# Altium project AVR32DA48_DEV.PrjPcb
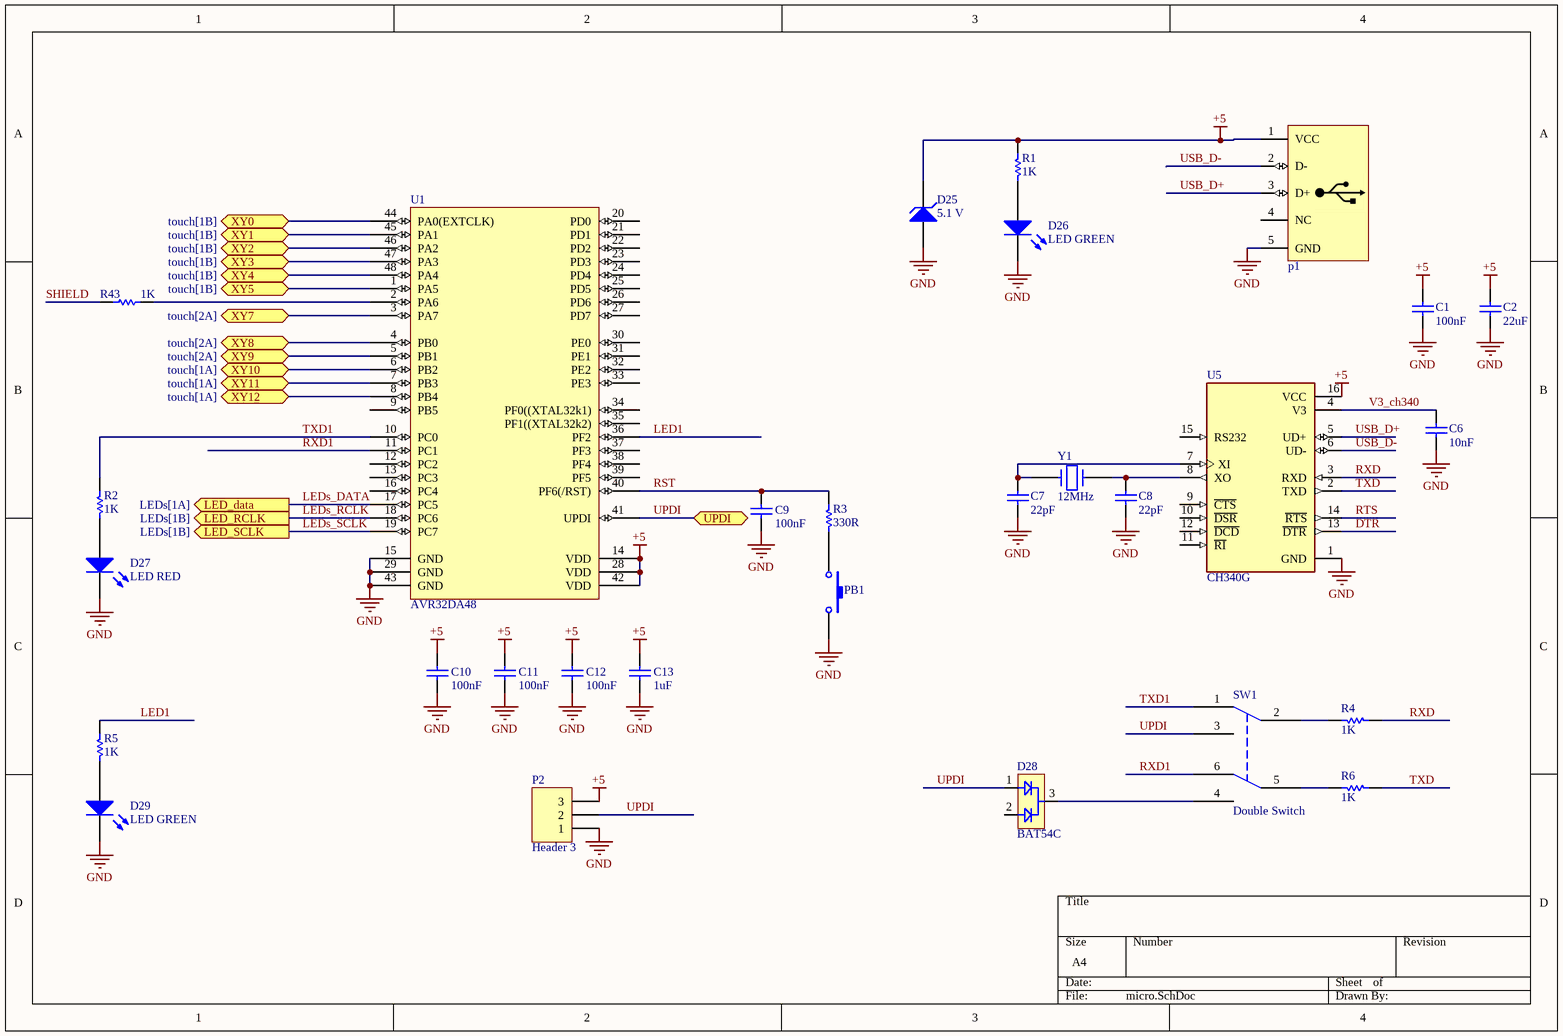
[diagram p0: micro.SchDoc]
3 sheets, 122 parts. Net scope: flat (ports and power ports of the same name join across sheets).
Board file: QTouch_test1.PcbDoc
Sheets:
  micro.SchDoc
  touch.SchDoc
  LEDs.SchDoc

## Sheet micro.SchDoc
size A4; SheetNumber: 1; SheetTotal: 3

### Parts
C1  100nF  [SMD_CAP_0805]
C2  22uF  [SMD_CAP_0805]
C6  10nF  [SMD_CAP_0805]
C7  22pF  [SMD_CAP_0805]
C8  22pF  [SMD_CAP_0805]
C9  value 100nF  [CAP0805]  (hidden comment: cap 100nF)
C10  value 100nF  [CAP0805]  (hidden comment: cap 100nF)
C11  value 100nF  [CAP0805]  (hidden comment: cap 100nF)
C12  value 100nF  [CAP0805]  (hidden comment: cap 100nF)
C13  value 1uF  [CAP0805]  (hidden comment: cap 1uF)
D25  Voltage: 5.1 V  [Diode 1n4148 SMD]  (hidden comment: Diode Zener)
D26  LED GREEN  [LED_0805 G]
D27  LED RED  [LED_0805 G]
D28  BAT54C  [SOT-23]
D29  LED GREEN  [LED_0805 G]
p1  USB Connector  [USB_AB_BM_SHS]  (value not drawn)
P2  Header 3  [HDR1X3]
PB1  Push-Button-tall  [tack-sw-3x5x6]  (value not drawn)
R1  value 1K  [RES0805]  (hidden comment: Res 1K)
R2  value 1K  [RES0805]  (hidden comment: Res 1K)
R3  value 330R  [RES0805]  (hidden comment: Res 330R)
R4  value 1K  [RES0805]  (hidden comment: Res 1K)
R5  value 1K  [RES0805]  (hidden comment: Res 1K)
R6  value 1K  [RES0805]  (hidden comment: Res 1K)
R43  1K  [RES 0805 (2012X06L)]
SW1  Double Switch  [switch_2way_DPDT_right]
U1  AVR32DA48  [TQPF48]
U5  CH340G  [SOIC16_N]
Y1  12MHz  [XTAL_SMD]

### Ports
LED_data (out, see LEDs[1A]), LED_RCLK (out, see LEDs[1B]), LED_SCLK (out, see LEDs[1B]), UPDI (bidir), XY0 (bidir, see touch[1B]), XY1 (bidir, see touch[1B]), XY2 (bidir, see touch[1B]), XY3 (bidir, see touch[1B]), XY4 (bidir, see touch[1B]), XY5 (bidir, see touch[1B]), XY7 (bidir, see touch[2A]), XY8 (bidir, see touch[2A]), XY9 (bidir, see touch[2A]), XY10 (bidir, see touch[1A]), XY11 (bidir, see touch[1A]), XY12 (bidir, see touch[1A])

### Nets
+5: C1.2 C2.2 C10.2 C11.2 C12.2 C13.2 D25.2(K) p1.1(VCC) P2.3 R1.1 U1.14(VDD) U1.28(VDD) U1.42(VDD) U5.16(VCC)
GND: C1.1 C2.1 C6.1 C7.1 C8.1 C9.1 C10.1 C11.1 C12.1 C13.1 D25.1(A) D26.2(K) D27.2(K) D29.2(K) p1.5(GND) P2.1 PB1.1 U1.15(GND) U1.29(GND) U1.43(GND) U5.1(GND)
DTR: U5.13(~{DTR})
LED1: R5.1 U1.36(PF2)
LEDs_DATA: U1.17(PC5) ; port LED_data
LEDs_RCLK: U1.18(PC6) ; port LED_RCLK
LEDs_SCLK: U1.19(PC7) ; port LED_SCLK
RST: C9.2 R3.1 U1.40(PF6(/RST))
RTS: U5.14(~{RTS})
RXD: R4.2 U5.3(RXD)
RXD1: SW1.6 U1.11(PC1)
SHIELD: R43.2
TXD: R6.2 U5.2(TXD)
TXD1: R2.1 SW1.1 U1.10(PC0)
UPDI: D28.1 P2.2 SW1.3 U1.41(UPDI) ; port UPDI
USB_D+: p1.3(D+) U5.5(UD+)
USB_D-: p1.2(D-) U5.6(UD-)
V3_ch340: C6.2 U5.4(V3)
NetC7_2: C7.2 U5.7(XI) Y1.1
NetC8_2: C8.2 U5.8(XO) Y1.2
NetD26_1: D26.1(A) R1.2
NetD27_1: D27.1(A) R2.2
NetD28_3: D28.3 SW1.4
NetD29_1: D29.1(A) R5.2
NetPB1_2: PB1.2 R3.2
NetR4_1: R4.1 SW1.2
NetR6_1: R6.1 SW1.5
NetR7_2: U1.7(PB3) ; port XY11
NetR8_2: U1.5(PB1) ; port XY9
NetR9_2: U1.6(PB2) ; port XY10
NetR10_2: U1.3(PA7) ; port XY7
NetR11_2: U1.8(PB4) ; port XY12
NetR12_2: U1.4(PB0) ; port XY8
NetR13_2: U1.46(PA2) ; port XY2
NetR14_2: U1.45(PA1) ; port XY1
NetR15_2: U1.44(PA0(EXTCLK)) ; port XY0
NetR16_2: U1.1(PA5) ; port XY5
NetR41_2: U1.48(PA4) ; port XY4
NetR42_2: U1.47(PA3) ; port XY3
NetR43_1: R43.1 U1.2(PA6)

Not connected (* = marked no-connect by the designer): D28 2; p1 4(NC); U1 9(PB5) 12(PC2) 13(PC3) 16(PC4) 20(PD0) 21(PD1) 22(PD2) 23(PD3) 24(PD4) 25(PD5) 26(PD6) 27(PD7) 30(PE0) 31(PE1) 32(PE2) 33(PE3) 34(PF0((XTAL32k1)) 35(PF1((XTAL32k2)) 37(PF3) 38(PF4) 39(PF5); U5 9(~{CTS}) 10(~{DSR}) 11(~{RI}) 12(~{DCD}) 15(RS232)

### Library data of the parts
C1 C2 C6-C8 = Cap: CAP SMD 0805; Published: 8-Jun-2000; LatestRevisionDate: 17-Jul-2002; LatestRevisionNote: Re-released for DXP Platform.; PackageReference: RAD-0.3; Publisher: Altium Limited; PackageDescription: Radial Cap, Thru-Hole; 2 Leads; 0.3 in Pin Spacing
  C1: Value: 100nF
  C2: Value: 22uF
  C6: Value: 10nF
  C7 C8: Value: 22pF
C9-C13 = Cap ceramic: CAP seramic
D25 = Diode Zener: Zener Diode; Designer: Saeid Jorablo; Company: E.P.I.L; Design Date: 2011/11/02
D26 D29 = LED0: LED SMD 0805 GREEN; Published: 8-Jun-2000; LatestRevisionDate: 08-Jul-2005; LatestRevisionNote: Mech Layer 1 removed.; PackageReference: LED-0; Publisher: Altium Limited; PackageDescription: LED; 2 Leads
D27 = LED0: LED SMD 0805 RED; Published: 8-Jun-2000; LatestRevisionDate: 08-Jul-2005; LatestRevisionNote: Mech Layer 1 removed.; PackageReference: LED-0; Publisher: Altium Limited; PackageDescription: LED; 2 Leads
p1 = USB MICRO: USB Connector MICRO-B Type; Designer: ABBAS BASEREH; Max Current: 1600mA; Mounting Technology: Surface Mount\Through-Hole; Category: Connector; Pin Count: 5-7; Publisher: ABBAS BASEREH; Status: Unreleased; ComponentLink1Description: Datasheet; ComponentLink2Description: Reference; Update: 1395-11-17
P2 = Header 3: Header, 3-Pin; LatestRevisionDate: 17-Jul-2002; LatestRevisionNote: Re-released for DXP Platform.; Publisher: Altium Limited
R1-R6 R43 = Res1: Resistor; Published: 8-Jun-2000; LatestRevisionDate: 17-Jul-2002; LatestRevisionNote: Re-released for DXP Platform.; PackageReference: AXIAL-0.3; Publisher: Altium Limited; PackageDescription: Axial Device, Thru-Hole; 2 Leads; 0.3 in Pin Spacing
  R43: Value: 1K
SW1 = Switch - DPDT: DPDT Switch
U5 = CH340G: USB Interface Integrated Circuit; MF: WCH; Price: None; SnapEDA_Link: https://www.snapeda.com/parts/Ch340G/WCH/view-part/?ref=snap; MP: Ch340G; Value: *; Availability: Not in stock; Package: None; Check_prices: https://www.snapeda.com/parts/Ch340G/WCH/view-part/?ref=eda
Y1 = CRYSTAL

## Sheet touch.SchDoc
size A4; SheetNumber: 2; SheetTotal: 3
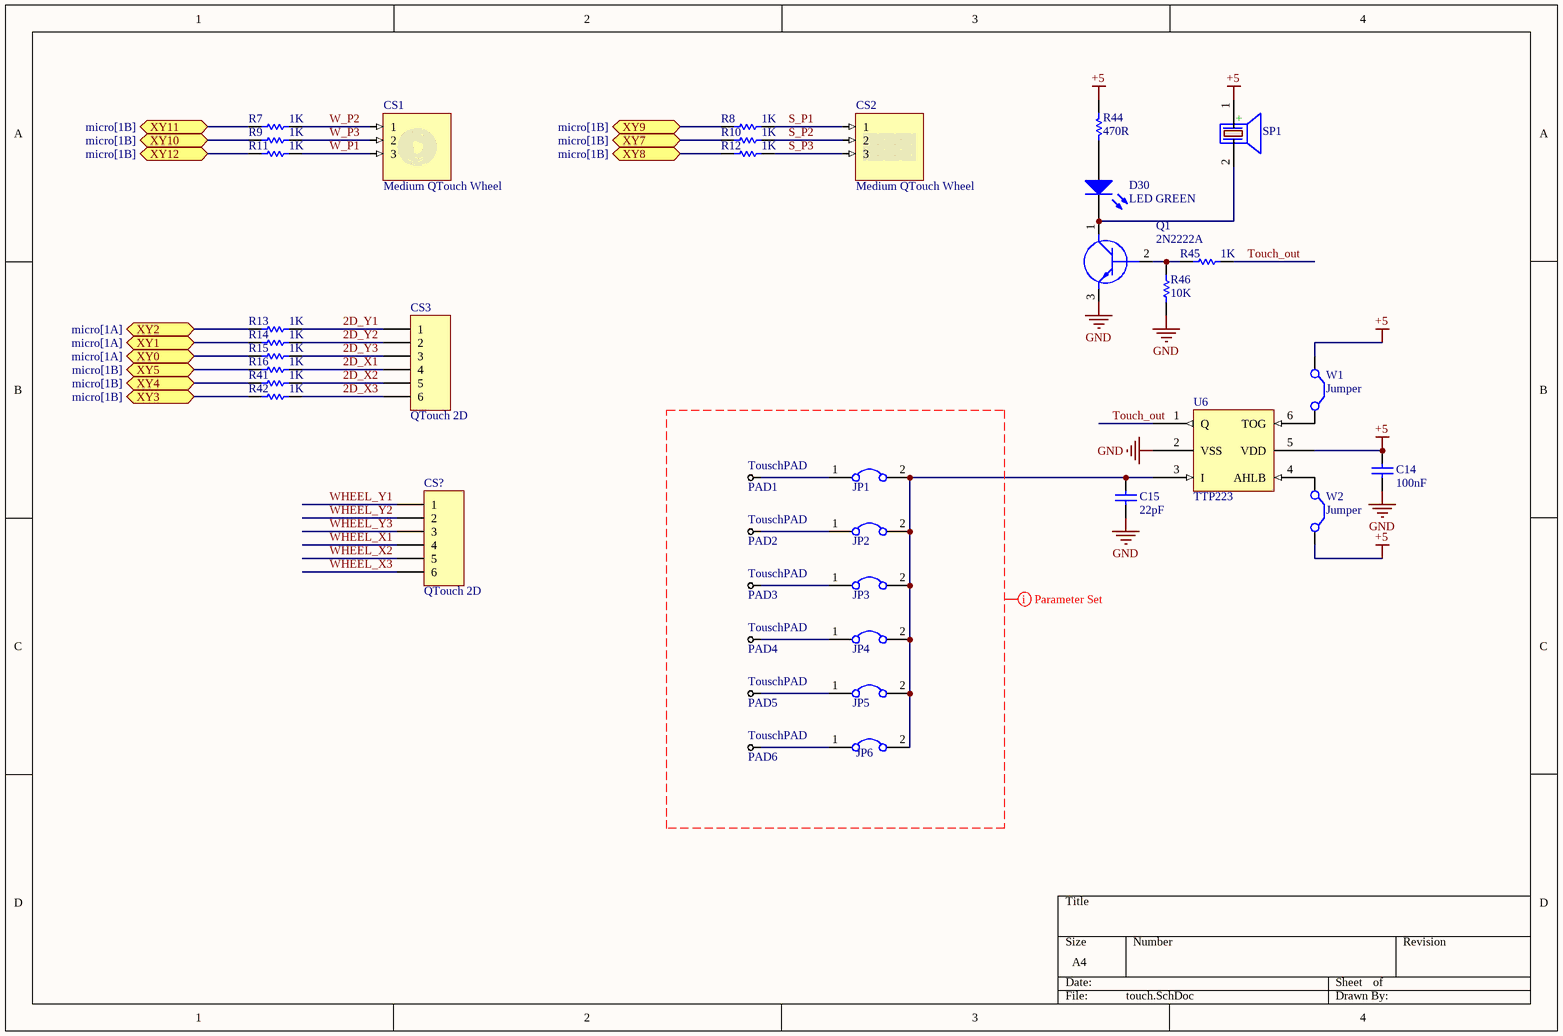
[diagram p1: touch.SchDoc]

### Parts
C14  value 100nF  [CAP0805]  (hidden comment: cap 100nF)
C15  value 22pF  [CAP0805]  (hidden comment: cap 22pF)
CS1  Medium QTouch Wheel  (no BOM)
CS2  Medium QTouch Wheel  (no BOM)
CS3  QTouch 2D  [2D_touch surface]
CS?  QTouch 2D  [wheel]
D30  LED GREEN  [LED_0805 G]
JP1  Jumper  [Jumper Small - 2.54 - GRAY]  (value not drawn)
JP2  Jumper  [Jumper Small - 2.54 - GRAY]  (value not drawn)
JP3  Jumper  [Jumper Small - 2.54 - GRAY]  (value not drawn)
JP4  Jumper  [Jumper Small - 2.54 - GRAY]  (value not drawn)
JP5  Jumper  [Jumper Small - 2.54 - GRAY]  (value not drawn)
JP6  Jumper  [Jumper Small - 2.54 - GRAY]  (value not drawn)
PAD1  TouschPAD  [touchpad1]  (no BOM)
PAD2  TouschPAD  [touchpad2]  (no BOM)
PAD3  TouschPAD  [touchpad3]  (no BOM)
PAD4  TouschPAD  [touchpad4]  (no BOM)
PAD5  TouschPAD  [touchpad5]  (no BOM)
PAD6  TouschPAD  [touchpad6]  (no BOM)
Q1  2N2222A  [SOT23_M]
R7  1K  [RES 0805 (2012X06L)]
R8  1K  [RES 0805 (2012X06L)]
R9  1K  [RES 0805 (2012X06L)]
R10  1K  [RES 0805 (2012X06L)]
R11  1K  [RES 0805 (2012X06L)]
R12  1K  [RES 0805 (2012X06L)]
R13  1K  [RES 0805 (2012X06L)]
R14  1K  [RES 0805 (2012X06L)]
R15  1K  [RES 0805 (2012X06L)]
R16  1K  [RES 0805 (2012X06L)]
R41  1K  [RES 0805 (2012X06L)]
R42  1K  [RES 0805 (2012X06L)]
R44  value 470R  [RES0805]  (hidden comment: Res 470R)
R45  1K  [RES 0805 (2012X06L)]
R46  10K  [RES 0805 (2012X06L)]
SP1  BUZZER  [BUZZER 7.62mm DC]  (value not drawn)
U6  TTP223  [SOT23-6_L]
W1  Jumper  [JUMPER]  (no BOM)
W2  Jumper  [JUMPER]  (no BOM)

### Ports
XY0 (bidir, see micro[1A]), XY1 (bidir, see micro[1A]), XY2 (bidir, see micro[1A]), XY3 (bidir, see micro[1B]), XY4 (bidir, see micro[1B]), XY5 (bidir, see micro[1B]), XY7 (bidir, see micro[1B]), XY8 (bidir, see micro[1B]), XY9 (bidir, see micro[1B]), XY10 (bidir, see micro[1B]), XY11 (bidir, see micro[1B]), XY12 (bidir, see micro[1B])

### Nets
+5: C14.2 R44.1 SP1.1(+) U6.5(VDD) W1.1(C1) W2.2(C2)
GND: C14.1 C15.1 Q1.3(E) R46.2 U6.2(VSS)
2D_X1: CS3.4 R16.1
2D_X2: CS3.5 R41.1
2D_X3: CS3.6 R42.1
2D_Y1: CS3.1 R13.1
2D_Y2: CS3.2 R14.1
2D_Y3: CS3.3 R15.1
S_P1: CS2.1 R8.1
S_P2: CS2.2 R10.1
S_P3: CS2.3 R12.1
Touch_out: R45.1 U6.1(Q)
W_P1: CS1.3 R11.1
W_P2: CS1.1 R7.1
W_P3: CS1.2 R9.1
WHEEL_X1: CS?.4
WHEEL_X2: CS?.5
WHEEL_X3: CS?.6
WHEEL_Y1: CS?.1
WHEEL_Y2: CS?.2
WHEEL_Y3: CS?.3
NetC15_2: C15.2 JP1.2 JP2.2 JP3.2 JP4.2 JP5.2 JP6.2 U6.3(I)
NetD30_1: D30.1(A) R44.2
NetD30_2: D30.2(K) Q1.1(C) SP1.2(-)
NetJP1_1: JP1.1 PAD1.1(T)
NetJP2_1: JP2.1 PAD2.1(T)
NetJP3_1: JP3.1 PAD3.1(T)
NetJP4_1: JP4.1 PAD4.1(T)
NetJP5_1: JP5.1 PAD5.1(T)
NetJP6_1: JP6.1 PAD6.1(T)
NetQ1_2: Q1.2(B) R45.2 R46.1
NetR7_2: R7.2 ; port XY11
NetR8_2: R8.2 ; port XY9
NetR9_2: R9.2 ; port XY10
NetR10_2: R10.2 ; port XY7
NetR11_2: R11.2 ; port XY12
NetR12_2: R12.2 ; port XY8
NetR13_2: R13.2 ; port XY2
NetR14_2: R14.2 ; port XY1
NetR15_2: R15.2 ; port XY0
NetR16_2: R16.2 ; port XY5
NetR41_2: R41.2 ; port XY4
NetR42_2: R42.2 ; port XY3
NetU6_4: U6.4(AHLB) W2.1(C1)
NetU6_6: U6.6(TOG) W1.2(C2)

### Layout directives
net class touch_pads: (no net found under the mark)

### Library data of the parts
C14 C15 = Cap ceramic: CAP seramic
CS1 = MediumQTouchWheel: ConfiguratorName: ATMEL_TOUCH; ConfigurationParameters: {}__sensorid[8]{}odiameter[60]{}idiameter[30]{}gapthickness[0.3]{}
CS2 = MediumQTouchWheel: ConfiguratorName: ATMEL_TOUCH; ConfigurationParameters: {}__sensorid[4]{}width[50]{}height[12]{}gapthickness[0.3]{}
CS3 CS? = Header 6: 3 by 3 2D touch surface; LatestRevisionDate: 17-Jul-2002; LatestRevisionNote: Re-released for DXP Platform.; Publisher: Altium Limited
D30 = LED0: LED SMD 0805 GREEN; Published: 8-Jun-2000; LatestRevisionDate: 08-Jul-2005; LatestRevisionNote: Mech Layer 1 removed.; PackageReference: LED-0; Publisher: Altium Limited; PackageDescription: LED; 2 Leads
JP1-JP6 = Jumper: Company: E.P.I.L; Defualt State: Close; Design Date: 2011/11/02
PAD1-PAD6 = Test Point
Q1 = 2N2222A: Transistor BJT NPN SMD; Manufacturer_Name: Foshan Blue Rocket Elec; Datasheet Link: https://datasheet.lcsc.com/szlcsc/1901291437_Foshan-Blue-Rocket-Elec-2N2222A_C358533.pdf; Height: 4.7mm; Manufacturer_Part_Number: 2N2222A
R7-R16 R41 R42 R44-R46 = Res1: Resistor; Published: 8-Jun-2000; LatestRevisionDate: 17-Jul-2002; LatestRevisionNote: Re-released for DXP Platform.; PackageReference: AXIAL-0.3; Publisher: Altium Limited; PackageDescription: Axial Device, Thru-Hole; 2 Leads; 0.3 in Pin Spacing
  R7-R16 R41 R42 R45: Value: 1K
  R46: Value: 10K
SP1 = PIEZO BUZZER: PIEZO BUZZER 5VOLTS; Designer: Abbas Basereh; Comment_1: SPEAKER AND BEEP; Design Date: 1395/11/14; ComponentLink2Description: Reference; PackageDescription: THD; Publisher: Abbas Basereh; Mounting Technology: THD; Pin Count: 2; Status: Unreleased
U6 = ttp223b: capacitive touch IC
W1 W2 = Jumper: Jumper Wire; Published: 24-Mar-1999; LatestRevisionDate: 17-Jul-2002; LatestRevisionNote: Re-released for DXP Platform.; PackageReference: RAD-0.2; Publisher: Altium Limited; PackageDescription: Radial Cap, Thru-Hole; 2 Leads; 0.2 in Pin Spacing

## Sheet LEDs.SchDoc
size A4; SheetNumber: 3; SheetTotal: 3
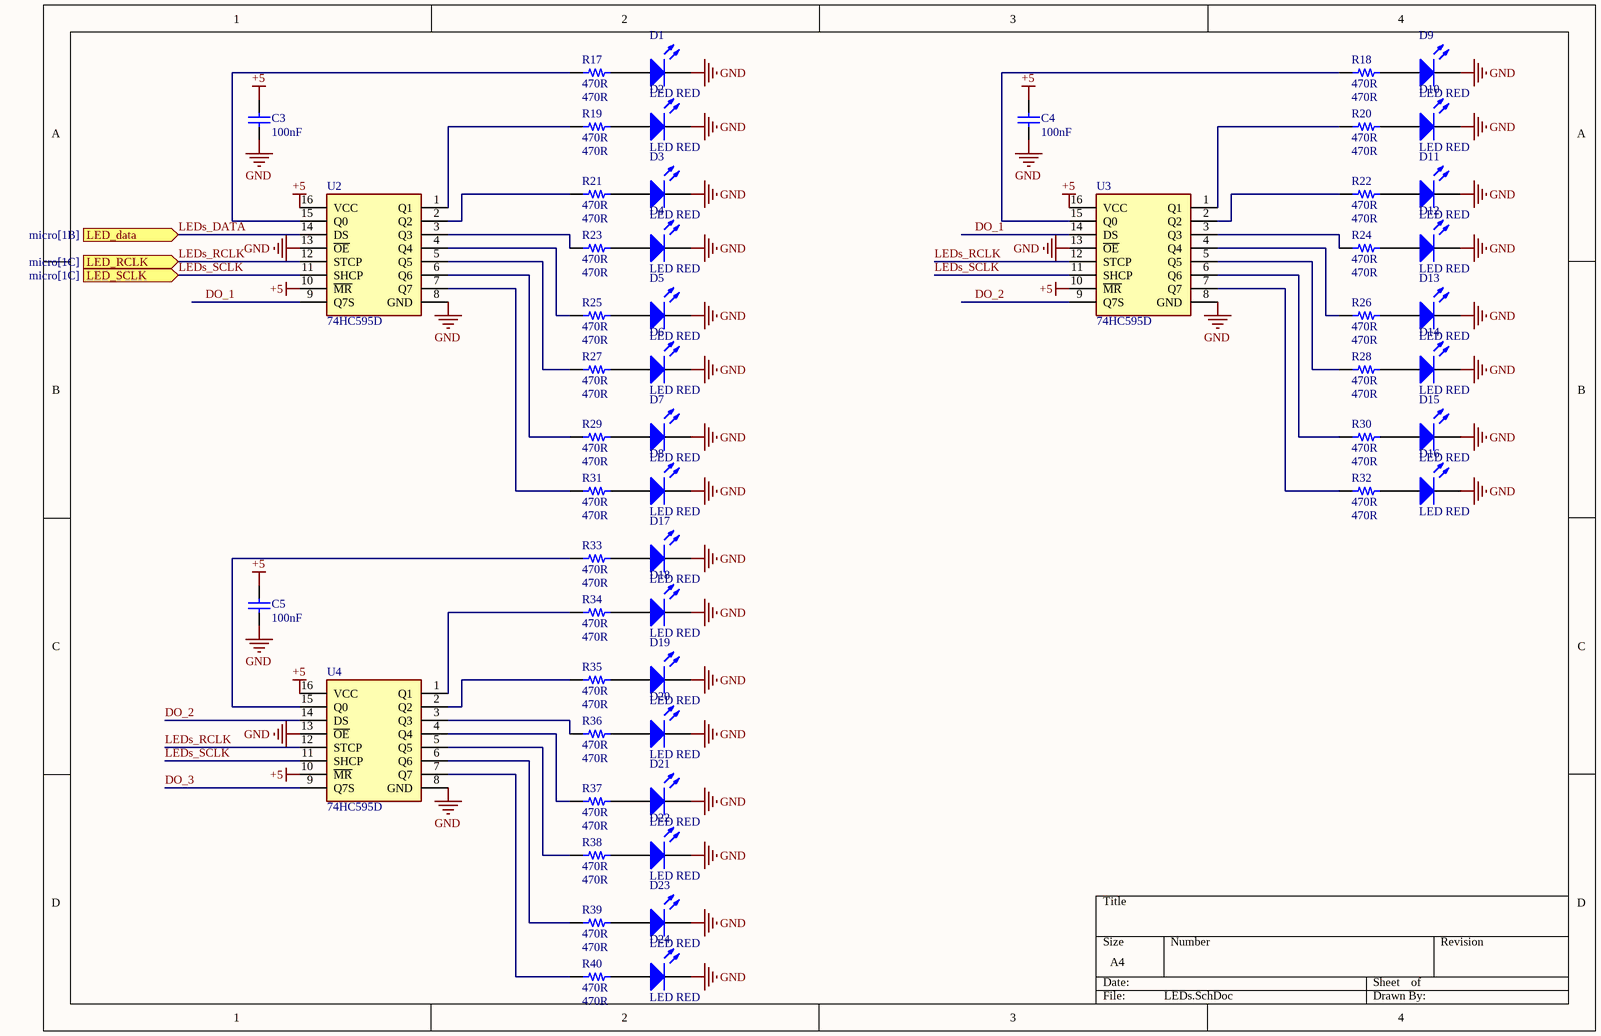
[diagram p2: LEDs.SchDoc]

### Parts
C3  100nF  [SMD_CAP_0805]
C4  100nF  [SMD_CAP_0805]
C5  100nF  [SMD_CAP_0805]
D1  LED RED  [LED_0805 G]
D2  LED RED  [LED_0805 G]
D3  LED RED  [LED_0805 G]
D4  LED RED  [LED_0805 G]
D5  LED RED  [LED_0805 G]
D6  LED RED  [LED_0805 G]
D7  LED RED  [LED_0805 G]
D8  LED RED  [LED_0805 G]
D9  LED RED  [LED_0805 G]
D10  LED RED  [LED_0805 G]
D11  LED RED  [LED_0805 G]
D12  LED RED  [LED_0805 G]
D13  LED RED  [LED_0805 G]
D14  LED RED  [LED_0805 G]
D15  LED RED  [LED_0805 G]
D16  LED RED  [LED_0805 G]
D17  LED RED  [LED_0805 G]
D18  LED RED  [LED_0805 G]
D19  LED RED  [LED_0805 G]
D20  LED RED  [LED_0805 G]
D21  LED RED  [LED_0805 G]
D22  LED RED  [LED_0805 G]
D23  LED RED  [LED_0805 G]
D24  LED RED  [LED_0805 G]
R17  470R  [RES0805]
R18  470R  [RES0805]
R19  470R  [RES0805]
R20  470R  [RES0805]
R21  470R  [RES0805]
R22  470R  [RES0805]
R23  470R  [RES0805]
R24  470R  [RES0805]
R25  470R  [RES0805]
R26  470R  [RES0805]
R27  470R  [RES0805]
R28  470R  [RES0805]
R29  470R  [RES0805]
R30  470R  [RES0805]
R31  470R  [RES0805]
R32  470R  [RES0805]
R33  470R  [RES0805]
R34  470R  [RES0805]
R35  470R  [RES0805]
R36  470R  [RES0805]
R37  470R  [RES0805]
R38  470R  [RES0805]
R39  470R  [RES0805]
R40  470R  [RES0805]
U2  74HC595D  [SOIC127P600X175-16N]
U3  74HC595D  [SOIC127P600X175-16N]
U4  74HC595D  [SOIC127P600X175-16N]

### Ports
LED_data (in, see micro[1B]), LED_RCLK (in, see micro[1C]), LED_SCLK (in, see micro[1C])

### Nets
+5: C3.2 C4.2 C5.2 U2.10(~{MR}) U2.16(VCC) U3.10(~{MR}) U3.16(VCC) U4.10(~{MR}) U4.16(VCC)
GND: C3.1 C4.1 C5.1 D1.2(K) D2.2(K) D3.2(K) D4.2(K) D5.2(K) D6.2(K) D7.2(K) D8.2(K) D9.2(K) D10.2(K) D11.2(K) D12.2(K) D13.2(K) D14.2(K) D15.2(K) D16.2(K) D17.2(K) D18.2(K) D19.2(K) D20.2(K) D21.2(K) D22.2(K) D23.2(K) D24.2(K) U2.8(GND) U2.13(~{OE}) U3.8(GND) U3.13(~{OE}) U4.8(GND) U4.13(~{OE})
DO_1: U2.9(Q7S) U3.14(DS)
DO_2: U3.9(Q7S) U4.14(DS)
DO_3: U4.9(Q7S)
LEDs_DATA: U2.14(DS) ; port LED_data
LEDs_RCLK: U2.12(STCP) U3.12(STCP) U4.12(STCP) ; port LED_RCLK
LEDs_SCLK: U2.11(SHCP) U3.11(SHCP) U4.11(SHCP) ; port LED_SCLK
NetD1_1: D1.1(A) R17.1
NetD2_1: D2.1(A) R19.1
NetD3_1: D3.1(A) R21.1
NetD4_1: D4.1(A) R23.1
NetD5_1: D5.1(A) R25.1
NetD6_1: D6.1(A) R27.1
NetD7_1: D7.1(A) R29.1
NetD8_1: D8.1(A) R31.1
NetD9_1: D9.1(A) R18.1
NetD10_1: D10.1(A) R20.1
NetD11_1: D11.1(A) R22.1
NetD12_1: D12.1(A) R24.1
NetD13_1: D13.1(A) R26.1
NetD14_1: D14.1(A) R28.1
NetD15_1: D15.1(A) R30.1
NetD16_1: D16.1(A) R32.1
NetD17_1: D17.1(A) R33.1
NetD18_1: D18.1(A) R34.1
NetD19_1: D19.1(A) R35.1
NetD20_1: D20.1(A) R36.1
NetD21_1: D21.1(A) R37.1
NetD22_1: D22.1(A) R38.1
NetD23_1: D23.1(A) R39.1
NetD24_1: D24.1(A) R40.1
NetR17_2: R17.2 U2.15(Q0)
NetR18_2: R18.2 U3.15(Q0)
NetR19_2: R19.2 U2.1(Q1)
NetR20_2: R20.2 U3.1(Q1)
NetR21_2: R21.2 U2.2(Q2)
NetR22_2: R22.2 U3.2(Q2)
NetR23_2: R23.2 U2.3(Q3)
NetR24_2: R24.2 U3.3(Q3)
NetR25_2: R25.2 U2.4(Q4)
NetR26_2: R26.2 U3.4(Q4)
NetR27_2: R27.2 U2.5(Q5)
NetR28_2: R28.2 U3.5(Q5)
NetR29_2: R29.2 U2.6(Q6)
NetR30_2: R30.2 U3.6(Q6)
NetR31_2: R31.2 U2.7(Q7)
NetR32_2: R32.2 U3.7(Q7)
NetR33_2: R33.2 U4.15(Q0)
NetR34_2: R34.2 U4.1(Q1)
NetR35_2: R35.2 U4.2(Q2)
NetR36_2: R36.2 U4.3(Q3)
NetR37_2: R37.2 U4.4(Q4)
NetR38_2: R38.2 U4.5(Q5)
NetR39_2: R39.2 U4.6(Q6)
NetR40_2: R40.2 U4.7(Q7)

### Library data of the parts
C3-C5 = Cap: CAP SMD 0805; Published: 8-Jun-2000; LatestRevisionDate: 17-Jul-2002; LatestRevisionNote: Re-released for DXP Platform.; PackageReference: RAD-0.3; Publisher: Altium Limited; PackageDescription: Radial Cap, Thru-Hole; 2 Leads; 0.3 in Pin Spacing; Value: 100nF
D1-D24 = LED0: LED SMD 0805 RED; Published: 8-Jun-2000; LatestRevisionDate: 08-Jul-2005; LatestRevisionNote: Mech Layer 1 removed.; PackageReference: LED-0; Publisher: Altium Limited; PackageDescription: LED; 2 Leads
R17-R40 = Resistor: RES SMD 0603; Part Number: RCS0805100KFKEA; Value: 470R
U2-U4 = 74HC595D: 74HC595 SMD; Manufacturer_Name: Nexperia; Datasheet Link: https://componentsearchengine.com/Datasheets/2/74HC595D.pdf; Height: 1.75mm; Manufacturer_Part_Number: 74HC595D; Mouser Part Number: N/A; Mouser Price/Stock: https://www.mouser.com/Search/Refine.aspx?Keyword=N%2FA

## Nets that join several sheets
+5: micro (14 pins), touch (6 pins), LEDs (9 pins)
GND: micro (21 pins), touch (5 pins), LEDs (33 pins)
LEDs_DATA: micro (U1.17), LEDs (U2.14)
LEDs_RCLK: micro (U1.18), LEDs (U2.12 U3.12 U4.12)
LEDs_SCLK: micro (U1.19), LEDs (U2.11 U3.11 U4.11)
NetR7_2: micro (U1.7), touch (R7.2)
NetR8_2: micro (U1.5), touch (R8.2)
NetR9_2: micro (U1.6), touch (R9.2)
NetR10_2: micro (U1.3), touch (R10.2)
NetR11_2: micro (U1.8), touch (R11.2)
NetR12_2: micro (U1.4), touch (R12.2)
NetR13_2: micro (U1.46), touch (R13.2)
NetR14_2: micro (U1.45), touch (R14.2)
NetR15_2: micro (U1.44), touch (R15.2)
NetR16_2: micro (U1.1), touch (R16.2)
NetR41_2: micro (U1.48), touch (R41.2)
NetR42_2: micro (U1.47), touch (R42.2)